# Altium schematic sheet Pump Fan Control.SchDoc
size Tabloid; SheetNumber: 3; SheetTotal: 4
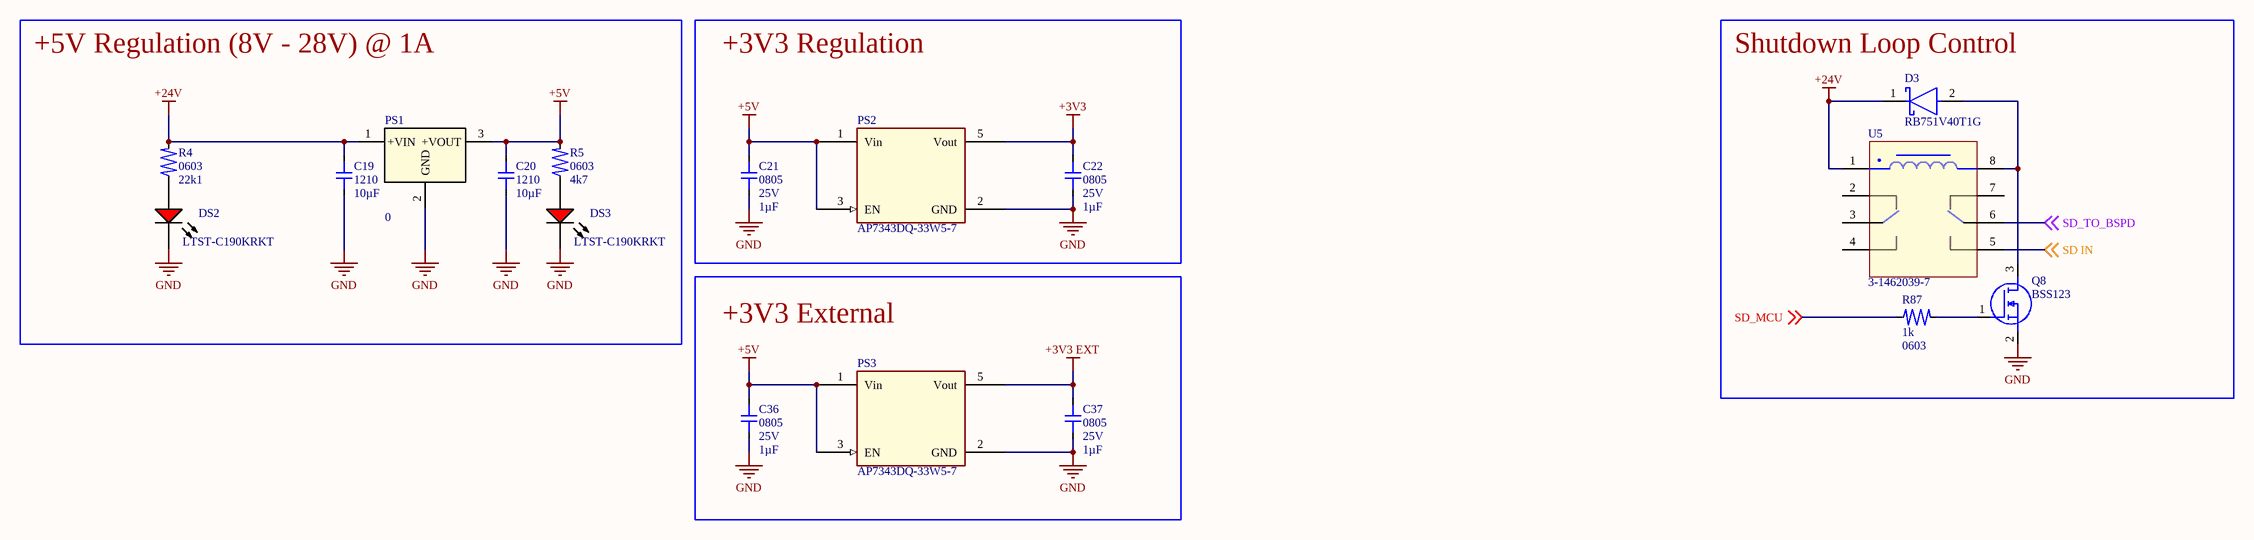
[diagram p0: Pump Fan Control.SchDoc]

## Parts
C19  value 10µF  Footprint: 1210  [FP-1210-L_3_2_0_3-W_2_5_0-MFG]  (hidden comment: Capacitor 10uF 1210 50V)
C20  value 10µF  Footprint: 1210  [FP-1210-L_3_2_0_3-W_2_5_0-MFG]  (hidden comment: Capacitor 10uF 1210 50V)
C21  value 1µF  Footprint: 0805  Voltage: 25V  [CAP-0805]  (hidden comment: Capacitor 1uF 0805 25V)
C22  value 1µF  Footprint: 0805  Voltage: 25V  [CAP-0805]  (hidden comment: Capacitor 1uF 0805 25V)
C36  value 1µF  Footprint: 0805  Voltage: 25V  [CAP-0805]  (hidden comment: Capacitor 1uF 0805 25V)
C37  value 1µF  Footprint: 0805  Voltage: 25V  [CAP-0805]  (hidden comment: Capacitor 1uF 0805 25V)
D3  RB751V40T1G  [FP-477-02-MFG]
DS2  LTST-C190KRKT  [LTST-C191KRKT_V]
DS3  LTST-C190KRKT  [LTST-C191KRKT_V]
PS1  value 0  [CONV_R-78E5.0-1.0]  (hidden comment: R-78E5.0-1.0)
PS2  AP7343DQ-33W5-7  [SOT95P285X140-5N]
PS3  AP7343DQ-33W5-7  [SOT95P285X140-5N]
Q8  BSS123  [SOT96P237X111-3N]
R4  value 22k1  Footprint: 0603  [RES-0603-Generic]  (hidden comment: Resistor 22k1 0603 1%)
R5  value 4k7  Footprint: 0603  [RES-0603-Generic]  (hidden comment: Resistor 4k7 0603 1%)
R87  value 1k  Footprint: 0603  [RES-0603-Generic]  (hidden comment: Resistor 1k 0603 1%)
U5  3-1462039-7  [3-1462039-7-Footprint-1]

## Blocks framed on the sheet
+5V Regulation (8V - 28V) @ 1A: C19 C20 DS2 DS3 PS1 R4 R5
+3V3 Regulation: C21 C22 PS2
Shutdown Loop Control: D3 Q8 R87 U5
+3V3 External: C36 C37 PS3

## Nets
+3V3: C22.2 PS2.5(Vout)
+3V3 EXT: C37.2 PS3.5(Vout)
+5V: C20.2 C21.2 C36.2 PS1.3(+VOUT) PS2.1(Vin) PS2.3(EN) PS3.1(Vin) PS3.3(EN) R5.2
+24V: C19.2 D3.1(C) PS1.1(+VIN) R4.2 U5.1
GND: C19.1 C20.1 C21.1 C22.1 C36.1 C37.1 DS2.2(K) DS3.2(K) PS1.2(GND) PS2.2(GND) PS3.2(GND) Q8.2(S)
SD IN: U5.5 ; off-sheet SD IN
SD_MCU: R87.1 ; off-sheet SD_MCU
SD_TO_BSPD: U5.6 ; off-sheet SD_TO_BSPD
NetD3_2: D3.2(A) Q8.3(D) U5.8
NetDS2_1: DS2.1(A) R4.1
NetDS3_1: DS3.1(A) R5.1
NetQ8_1: Q8.1(G) R87.2

Not connected (* = marked no-connect by the designer): PS2 4(NC); PS3 4(NC); U5 2 3 4 7

## Notes on the sheet
- THE UNIVERSITY OF AKRON
- SHEET SIZE
- TITLE
- PART NUMBER
- REVISION
- ANSI B
- LAST UPDATE
- SHEET
- (in symbol CMP-008-00016-1) .

## Library data of the parts
C19 C20 = CMP-001-00122-1: Capacitor 1210; Capacitor Type: Ceramic; Max Operating Temperature: 85°C; Pins: 2; Mounting Technology: Surface Mount; Case/Package: 1210; Min Operating Temperature: -55°C; RoHS Compliant: Yes; Voltage Rating: 50V
C21 C22 C36 C37 = CMP-00045-1: Capacitor, 0805
D3 = CMP-004-00075-1: Rectifier Diode, Schottky, 1 Phase, 1 Element, 0.03A, 40V V(RRM), Silicon; Forward Voltage: 370mV; Pins: 2; RoHS Compliant: Yes; Max Operating Temperature: 150°C; Min Operating Temperature: -55°C
DS2 DS3 = CMP-007-00024-2: LED Uni-Color Red, 62.5 mW, 25 mA, -30 to 85 degC, 2-Pin SMD, RoHS, Tape and Reel; Manufacturer: Lite-On; Power: 75mW; Forward Voltage: 2V; Luminous Intensity: 54mcd; Lens Style: Diffused; Viewing Angle: 130degrees; Forward Current: 20mA; Manufacturer URL: http://www.us.liteon.com/; Case/Package: 0603; Datasheet Version: Rev. F, 05/2013; Package Reference: C191KRKT; Datasheet URL: http://optoelectronics.liteon.com/upload/download/DS-22-99-0151/S_110_LTST-C190KRKT.pdf; Package Description: 2-Pin Surface Mount Device, Body 1.6 x 0.8 mm; Nominal Vf: 2V; Packaging: TapeandReel; RoHS Compliant: True; Pins: 2; Illumination Colour: Red; Colour: Red; Mounting Technology: SM; Package Quantity: 3000; Min Operating Temperature: -55°C; Max Operating Temperature: 85°C
PS1 = CMP-009-00214-2: Linear Regulator Replacement DC DC Converter 1 Output 5V - - 1A 8V - 28V Input; MF: Recom Power; Price: None; Availability: Unavailable; SnapEDA_Link: https://www.snapeda.com/parts/R-78E5.0-1.0/Recom%20Power/view-part/557753/?ref=snap; Case/Package: SIP-3 Recom Power; Design Item ID: R-78E5.0-1.0; MP: R-78E5.0-1.0; Source: Zips_Racing_Electric.SchLib
PS2 PS3 = CMP-019-00053-6: Fixed Positive LDO Regulator; Min Supply Voltage: 1.7V; Output Current: 300mA; Max Supply Voltage: 5.25V; Output Voltage: 3.3V; Dropout Voltage: 310mV; Mounting Technology: SMT; Min Operating Temperature: -40°C; Pins: 5; Case/Package: SOT-25; Max Operating Temperature: 125°C
Q8 = CMP-023-000002-1: MOSFET N-CH 100V 170MA SOT23-3; Manufacturer_Name: ON Semiconductor; Datasheet Link: http://uk.rs-online.com/web/p/products/6710321; Mouser Price/Stock: https://www.mouser.co.uk/ProductDetail/ON-Semiconductor-Fairchild/BSS123?qs=FOlmdCx%252BAA2Kf8SEB3qLYA%3D%3D; Arrow Part Number: BSS123; Arrow Price/Stock: https://www.arrow.com/en/products/bss123/on-semiconductor; Manufacturer_Part_Number: BSS123; Source: Zips_Racing_Electric.SchLib; Design Item ID: BSS123; Height: 1.11mm; Mouser Part Number: 512-BSS123
R4 = CMP-00029-1: Resistor, 0603, 1%, 1/10W; Power: 100mW; Tolerance: 1%; Datasheet: https://www.seielect.com/catalog/sei-rmcf_rmcp.pdf; Max Operating Temperature: 155°C; Min Operating Temperature: -55°C
R5 = CMP-00023-3: Resistor, 0603, 1%, 1/10W; Power: 100mW; Tolerance: 1%; Datasheet: https://www.seielect.com/catalog/sei-rmcf_rmcp.pdf; Max Operating Temperature: 155°C; Min Operating Temperature: -55°C
R87 = CMP-00021-7: Resistor, 0603, 1k; Power: 100mW; Max Operating Temperature: 155°C; Min Operating Temperature: -55°C; Datasheet: https://www.seielect.com/catalog/sei-rmcf_rmcp.pdf; Tolerance: 1%
U5 = CMP-008-00016-1: RF Relay, DPDT, Momentary, 0.008A (Coil), 24VDC (Coil), 200mW (Coil), 5A (Contact), 220VDC (Contact), 900MHz, 60W (RF Input), DC Input, AC/DC Output, Surface Mount-Straight; Operate Time: 8ms; Min Operating Temperature: -40°C; Mounting Technology: Surface Mount; Max Operating Temperature: 85°C; RoHS Compliant: Yes